# EAGLE design atmega16 laptop keyboard (EAGLE 6.4)
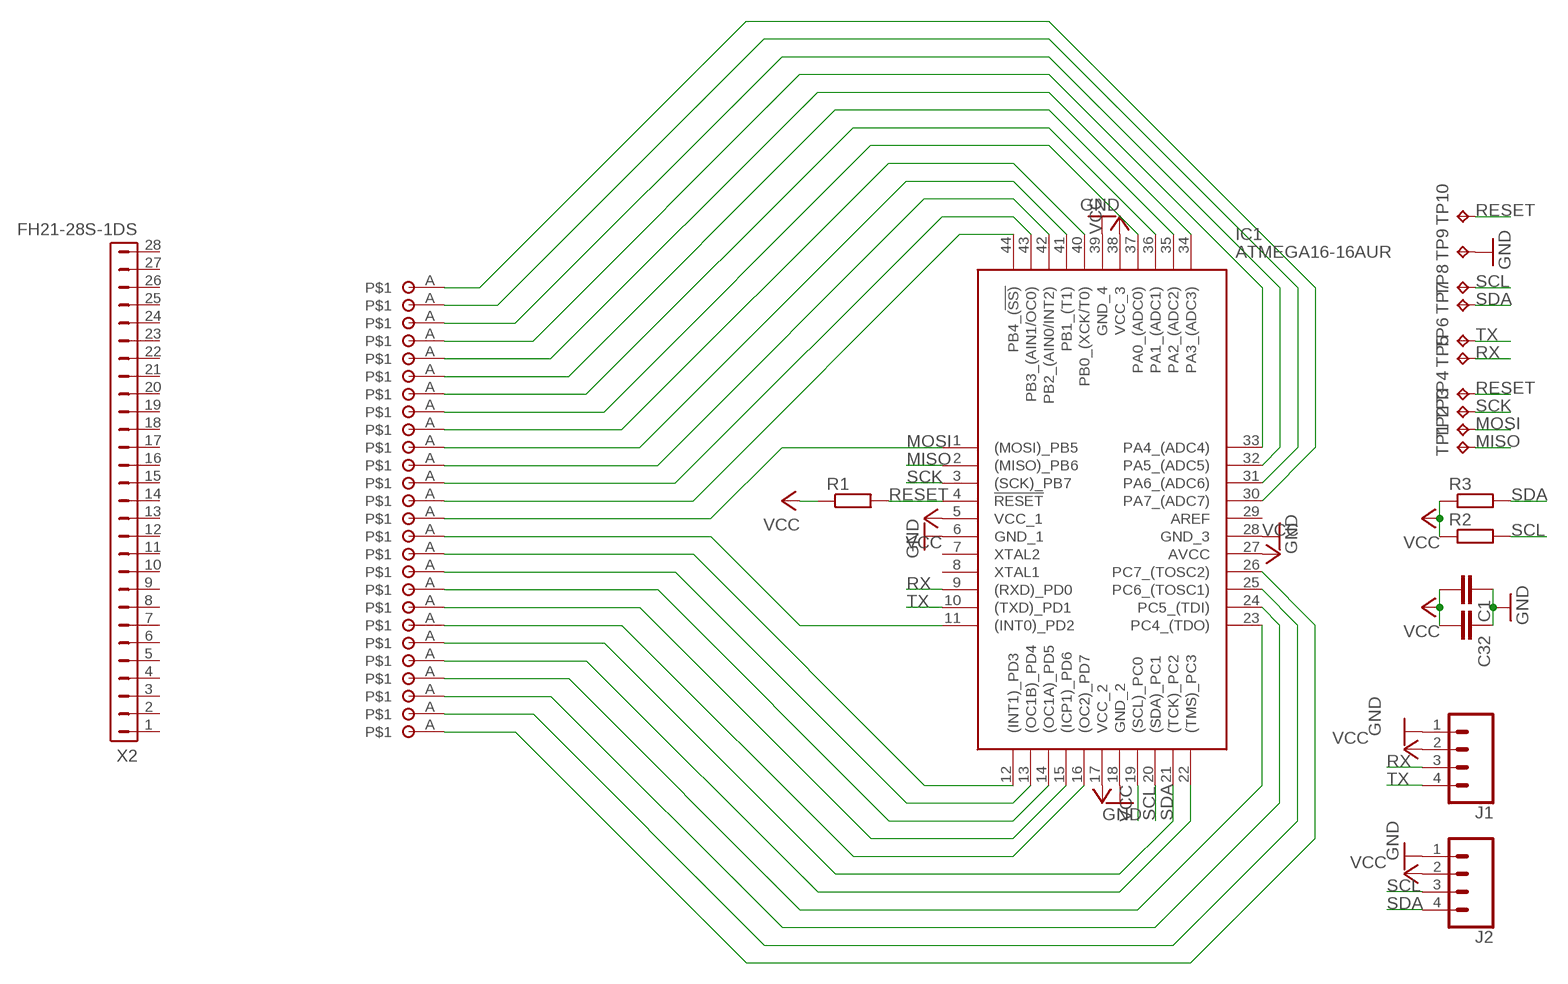
[diagram p0: schematic, sheet 1]

## Parts
C1  C-EUC0805  [C0805]
C32  C-EUC0805  [C0805]
IC1  ATMEGA16-16AUR  [QFP80P1200X1200X120-44N]
J1  CONN_04LONGPADS  [1X04_LONGPADS]
J2  CONN_04LONGPADS  [1X04_LONGPADS]
R1  R-EU_M0805  [M0805]
R2  R-EU_M0805  [M0805]
R3  R-EU_M0805  [M0805]
TP1  TPTP15R  [TP15R]
TP2  TPTP15R  [TP15R]
TP3  TPTP15R  [TP15R]
TP4  TPTP15R  [TP15R]
TP5  TPTP15R  [TP15R]
TP6  TPTP15R  [TP15R]
TP7  TPTP15R  [TP15R]
TP8  TPTP15R  [TP15R]
TP9  TPTP15R  [TP15R]
TP10  TPTP15R  [TP15R]
U$1  PAD1  [PAD1]
U$2  PAD1  [PAD1]
U$3  PAD1  [PAD1]
U$4  PAD1  [PAD1]
U$5  PAD1  [PAD1]
U$6  PAD1  [PAD1]
U$7  PAD1  [PAD1]
U$8  PAD1  [PAD1]
U$9  PAD1  [PAD1]
U$10  PAD1  [PAD1]
U$11  PAD1  [PAD1]
U$12  PAD1  [PAD1]
U$13  PAD1  [PAD1]
U$14  PAD1  [PAD1]
U$15  PAD1  [PAD1]
U$16  PAD1  [PAD1]
U$17  PAD1  [PAD1]
U$18  PAD1  [PAD1]
U$19  PAD1  [PAD1]
U$20  PAD1  [PAD1]
U$21  PAD1  [PAD1]
U$22  PAD1  [PAD1]
U$23  PAD1  [PAD1]
U$24  PAD1  [PAD1]
U$25  PAD1  [PAD1]
U$26  PAD1  [PAD1]
X2  FH21-28S-1DS  [FH21-28S-1DS]

## Nets
GND: C1.1 C32.1 IC1.6(GND_1) IC1.18(GND_2) IC1.28(GND_3) IC1.39(GND_4) J1.1 J2.1 TP9.TP
MISO: IC1.2((MISO)_PB6) TP1.TP
MOSI: IC1.1((MOSI)_PB5) TP2.TP U$14.A
N$1: IC1.11((INT0)_PD2) U$15.A
N$2: IC1.12((INT1)_PD3) U$16.A
N$3: IC1.13((OC1B)_PD4) U$17.A
N$4: IC1.14((OC1A)_PD5) U$18.A
N$5: IC1.15((ICP1)_PD6) U$19.A
N$6: IC1.16((OC2)_PD7) U$20.A
N$7: IC1.21((TCK)_PC2) U$21.A
N$8: IC1.22((TMS)_PC3) U$22.A
N$9: IC1.23(PC4_(TDO)) U$23.A
N$10: IC1.24(PC5_(TDI)) U$24.A
N$11: IC1.25(PC6_(TOSC1)) U$25.A
N$12: IC1.26(PC7_(TOSC2)) U$26.A
N$13: IC1.44(PB4_(!SS)) U$13.A
N$14: IC1.43(PB3_(AIN1/OC0)) U$12.A
N$15: IC1.42(PB2_(AIN0/INT2)) U$11.A
N$16: IC1.41(PB1_(T1)) U$10.A
N$17: IC1.40(PB0_(XCK/T0)) U$9.A
N$18: IC1.37(PA0_(ADC0)) U$8.A
N$19: IC1.36(PA1_(ADC1)) U$7.A
N$20: IC1.35(PA2_(ADC2)) U$6.A
N$21: IC1.34(PA3_(ADC3)) U$5.A
N$22: IC1.33(PA4_(ADC4)) U$4.A
N$23: IC1.32(PA5_(ADC5)) U$3.A
N$24: IC1.31(PA6_(ADC6)) U$2.A
N$25: IC1.30(PA7_(ADC7)) U$1.A
RESET: IC1.4(!RESET) R1.2 TP4.TP TP10.TP
RX: IC1.9((RXD)_PD0) J1.3 TP5.TP
SCK: IC1.3((SCK)_PB7) TP3.TP
SCL: IC1.19((SCL)_PC0) J2.3 R2.2 TP8.TP
SDA: IC1.20((SDA)_PC1) J2.4 R3.2 TP7.TP
TX: IC1.10((TXD)_PD1) J1.4 TP6.TP
VCC: C1.2 C32.2 IC1.5(VCC_1) IC1.17(VCC_2) IC1.27(AVCC) IC1.38(VCC_3) J1.2 J2.2 R1.1 R2.1 R3.1
Unconnected: IC1.7(XTAL2) IC1.8(XTAL1) IC1.29(AREF) X2.1 X2.2 X2.3 X2.4 X2.5 X2.6 X2.7 X2.8 X2.9 X2.10 X2.11 X2.12 X2.13 X2.14 X2.15 X2.16 X2.17 X2.18 X2.19 X2.20 X2.21 X2.22 X2.23 X2.24 X2.25 X2.26 X2.27 X2.28

## Library data of the parts
C1 C32 = resistor:C-EU: CAPACITOR, European symbol
IC1 = SamacSys_Parts:ATMEGA16-16AUR: IC MCU 8BIT 16KB FLASH 44TQFP Source: Datasheet <http://www.microchip.com/mymicrochip/filehandler.aspx?ddocname=en590660>; DESCRIPTION: IC MCU 8BIT 16KB FLASH 44TQFP; HEIGHT: 1.2mm; MANUFACTURER_NAME: Microchip; MANUFACTURER_PART_NUMBER: ATMEGA16-16AUR; MOUSER_PART_NUMBER: 556-ATMEGA16-16AUR; MOUSER_PRICE-STOCK: https://www.mouser.co.uk/ProductDetail/Microchip-Technology-Atmel/ATMEGA16-16AUR?qs=JV7lzlMm3yK8MP63%2FLxWcg%3D%3D
J1 J2 = SparkFun-Connectors:CONN_04: Multi connection point. Often used as Generic Header-pin footprint for 0.1 inch spaced/style header connections On any of the 0.1 inch spaced packages, you can populate with these: Break Away Headers - Straight <https://www.sparkfun.com/products/116> (PRT-00116) Break Away Male Headers - Right Angle <https://www.sparkfun.com/products/553> (PRT-00553) Female Headers <https://www.sparkfun.com/products/115> (PRT-00115) Break Away Headers - Machine Pin <https://www.sparkfun.com/products/117> (PRT-00117) Break Away Female Headers - Swiss Machine Pin <https://www.sparkfun.com/products/743> (PRT-00743) For SCREWTERMINALS and SPRING TERMINALS visit here: Screw Terimnals on SparkFun.com <https://www.sparkfun.com/search/results?term=Screw+Terminals> (5mm/3.5mm/2.54mm spacing) This device is also useful as a general connection point to wire up your design to another part of your project. Our various solder wires solder well into these plated through hole pads. Hook-Up Wire - Assortment (Stranded, 22 AWG) <https://www.sparkfun.com/products/11375> (PRT-11375) Hook-Up Wire - Assortment (Solid Core, 22 AWG) <https://www.sparkfun.com/products/11367> (PRT-11367) View the entire wire category on our website here <https://www.sparkfun.com/categories/141> Special notes: Molex polarized connector foot print use with SKU : PRT-08231 with associated crimp pins and housings. 1MM SMD Version SKU: PRT-10208; PROD_ID: CONN-09696
R1-R3 = rcl:R-EU_: RESISTOR, European symbol
TP1-TP10 = testpad:TP: Test pad
U$1-U$26 = PADS:PAD1
X2 = con-hirose:FH21-28S-1DS: FPC CONNECTOR Source: con-hirose.lbr from Bob Starr <rtzaudio@mindspring.com>; OC_FARNELL: unknown; OC_NEWARK: unknown

## Board
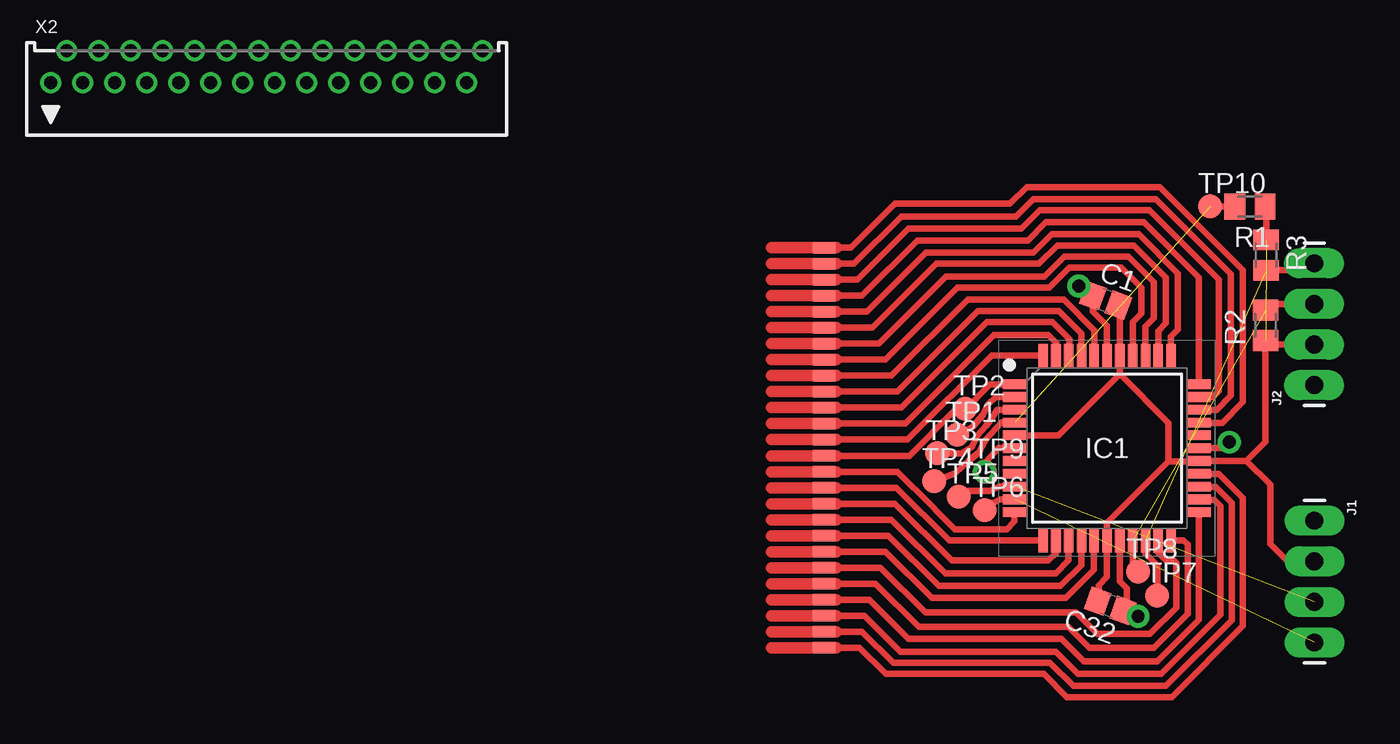
[diagram p1: board, top side]
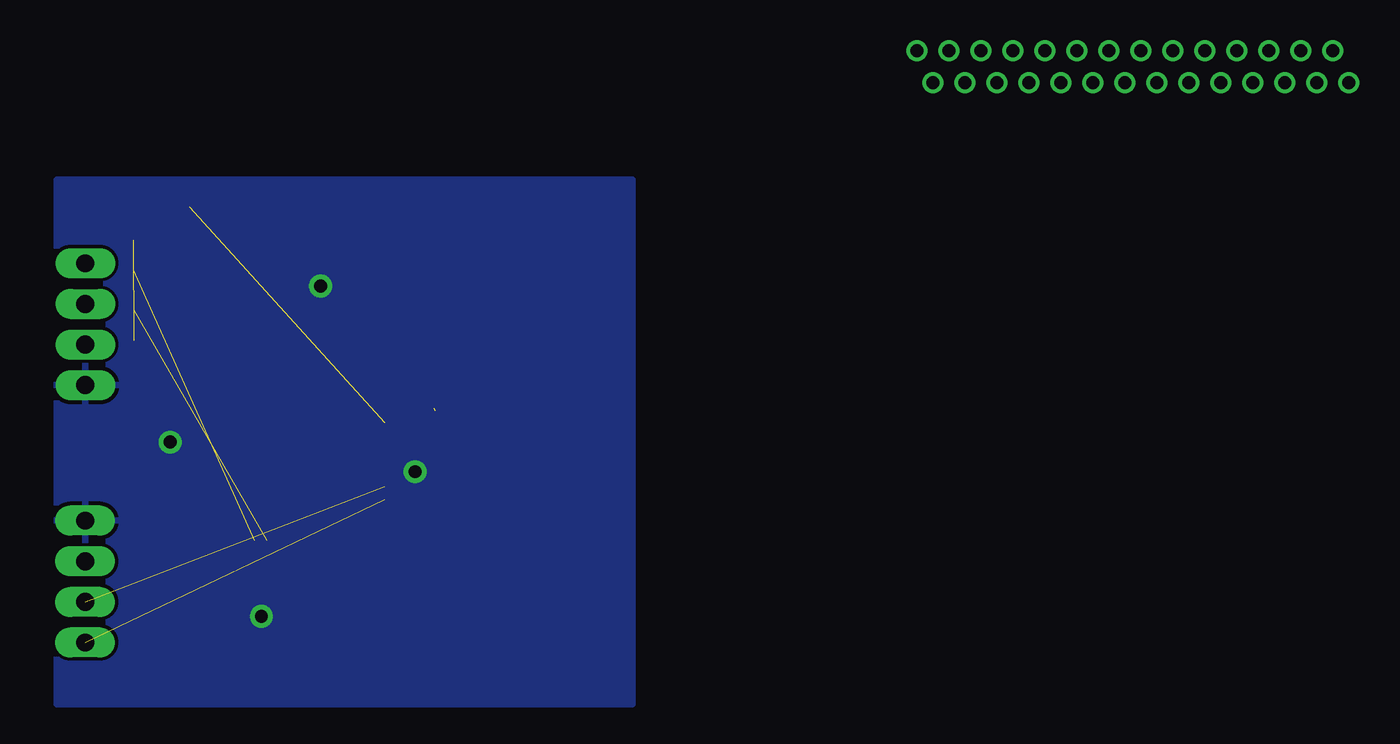
[diagram p2: board, bottom side, seen from below]

No outline drawn. Coordinates in mm, seen from the top.
Copper layers (1*16): Top 0.035mm / dielectric 1.5mm / Bottom 0.035mm
Design rules "default": minimum track width 10mil, minimum drill 24mil, track to track 8mil, track to pad 8mil, pad to pad 8mil, via to via 8mil, smd to smd 8mil, copper to edge 40mil, drill to drill 8mil, minimum pad ring 10mil, minimum via ring 8mil, stop-mask expansion 4mil, vias tented up to drill 0mil, thermal gap 10mil

### Footprints (pad centres in the part's own frame; a part is rotated, then mirrored left to right if it is on the bottom)
C0805 = smd 1.3 x 1.5: 1 -0.85,0; 2 0.85,0
QFP80P1200X1200X120-44N = smd 1.5 x 0.6: 1 -5.75,4; 2 -5.75,3.2; 3 -5.75,2.4; 4 -5.75,1.6; 5 -5.75,0.8; 6 -5.75,0; 7 -5.75,-0.8; 8 -5.75,-1.6; 9 -5.75,-2.4; 10 -5.75,-3.2; 11 -5.75,-4; 23 5.75,-4; 24 5.75,-3.2; 25 5.75,-2.4; 26 5.75,-1.6; 27 5.75,-0.8; 28 5.75,0; 29 5.75,0.8; 30 5.75,1.6; 31 5.75,2.4; 32 5.75,3.2; 33 5.75,4 | smd 0.6 x 1.5: 12 -4,-5.75; 13 -3.2,-5.75; 14 -2.4,-5.75; 15 -1.6,-5.75; 16 -0.8,-5.75; 17 0,-5.75; 18 0.8,-5.75; 19 1.6,-5.75; 20 2.4,-5.75; 21 3.2,-5.75; 22 4,-5.75; 34 4,5.75; 35 3.2,5.75; 36 2.4,5.75; 37 1.6,5.75; 38 0.8,5.75; 39 0,5.75; 40 -0.8,5.75; 41 -1.6,5.75; 42 -2.4,5.75; 43 -3.2,5.75; 44 -4,5.75
1X04_LONGPADS = drill 1.118 pad 1.88 long: 1 0,0; 2 2.54,0; 3 5.08,0; 4 7.62,0
M0805 = smd 1.3 x 1.6: 1 -0.95,0; 2 0.95,0
TP15R = smd 1.5 x 1.5: TP 0,0
PAD1 = smd 1.422 x 0.711: A 0.762,0
FH21-28S-1DS = drill 0.813: 1 -13.5,0; 2 -12.5,2; 3 -11.5,0; 4 -10.5,2; 5 -9.5,0; 6 -8.5,2; 7 -7.5,0; 8 -6.5,2; 9 -5.5,0; 10 -4.5,2; 11 -3.5,0; 12 -2.5,2; 13 -1.5,0; 14 -0.5,2; 15 0.5,0; 16 1.5,2; 17 2.5,0; 18 3.5,2; 19 4.5,0; 20 5.5,2; 21 6.5,0; 22 7.5,2; 23 8.5,0; 24 9.5,2; 25 10.5,0; 26 11.5,2; 27 12.5,0; 28 13.5,2

### Placement (x,y rotation side)
C1  -8.83,-68.19 340 top
C32  -8.54,-87.28 160 top
IC1  -8.74,-77.43 0 top
J1  4.22,-81.96 270 top
J2  4.21,-73.49 90 top
R1  0.19,-62.33 180 top
R2  1.17,-69.74 90 top
R3  1.2,-65.36 270 top
TP1  -18.1,-76.6 0 top
TP2  -17.6,-74.95 0 top
TP3  -19.35,-77.75 0 top
TP4  -19.55,-79.5 0 top
TP5  -18,-80.45 0 top
TP6  -16.4,-81.3 0 top
TP7  -5.6,-86.65 0 top
TP8  -6.8,-85.15 0 top
TP9  -16.4,-78.9 0 top
TP10  -2.3,-62.3 0 top
U$1  -25.65,-64.9 180 top
U$2  -25.65,-65.9 180 top
U$3  -25.65,-66.9 180 top
U$4  -25.65,-67.9 180 top
U$5  -25.65,-68.9 180 top
U$6  -25.65,-69.9 180 top
U$7  -25.65,-70.9 180 top
U$8  -25.65,-71.9 180 top
U$9  -25.65,-72.9 180 top
U$10  -25.65,-73.9 180 top
U$11  -25.65,-74.9 180 top
U$12  -25.65,-75.9 180 top
U$13  -25.65,-76.9 180 top
U$14  -25.65,-77.9 180 top
U$15  -25.65,-78.9 180 top
U$16  -25.65,-79.9 180 top
U$17  -25.65,-80.9 180 top
U$18  -25.65,-81.9 180 top
U$19  -25.65,-82.9 180 top
U$20  -25.65,-83.9 180 top
U$21  -25.65,-84.9 180 top
U$22  -25.65,-85.9 180 top
U$23  -25.65,-86.9 180 top
U$24  -25.65,-87.9 180 top
U$25  -25.65,-88.9 180 top
U$26  -25.65,-89.9 180 top
X2  -61.27,-54.57 0 top

### Tracks (layer width: path | path; a pad name or v marks a point on that pad's centre or on a via)
GND  (via drill 0.8 pad 1.42)
  Top 0.406: IC1.18 -7.94,-85.76 -7.5,-86.2 -7.5,-87.11 C32.1 -7.36,-87.95 v-6.8,-87.95 | IC1.6 -15.53,-77.43 -16.3,-78.3 TP9.TP | IC1.39 -8.75,-69.75 -9.63,-68.87 C1.1 -10.23,-67.3 v-10.5,-67.3 | IC1.28 -1.48,-77.43 v-1.1,-77.05
  other vias: -16.4,-78.9
  pour Bottom: -30,-93.45 6,-93.45 6,-60.65 -30,-60.65
MISO
  Top 0.406: IC1.2 -15.68,-74.23 -16.2,-74.7 -16.5,-75.35 -17.15,-76.1 TP1.TP
MOSI  (1 unrouted)
  Top 0.406: U$14.A -21.1,-77.9 -18.3,-75.1 -17.7,-75.1 -16.05,-73.45 -14.51,-73.45 IC1.1
N$1
  Top 0.406: U$15.A -21.85,-78.9 -19.7,-81.05 -19.35,-81.4 -18.25,-82.5 -15,-82.5 -14.52,-82.02 -14.52,-81.4 IC1.11
N$2
  Top 0.406: U$16.A -21.9,-79.9 -18.6,-83.2 -12.76,-83.2 IC1.12
N$3
  Top 0.406: U$17.A -22,-80.9 -18.45,-84.45 -12.4,-84.45 -11.95,-84 IC1.13
N$4
  Top 0.406: U$18.A -22.2,-81.9 -18.85,-85.25 -11.95,-85.25 -11.15,-84.45 IC1.14
N$5
  Top 0.406: U$19.A -22.4,-82.9 -19.25,-86.05 -11.65,-86.05 -10.35,-84.75 IC1.15
N$6
  Top 0.406: U$20.A -22.6,-83.9 -19.7,-86.8 -11.3,-86.8 -9.55,-85.05 IC1.16
N$7
  Top 0.406: U$21.A -22.9,-84.9 -20.1,-87.7 -10.7,-87.7 -9.35,-89.05 -6.05,-89.05 -4.4,-87.4 -4.4,-84.6 -4.6,-84.4 -5.1,-84.4 -5.55,-83.95 IC1.21
N$8
  Top 0.406: U$22.A -23.2,-85.9 -20.5,-88.6 -11.15,-88.6 -9.85,-89.9 -5.8,-89.9 -3.7,-87.8 -3.7,-83.45 -3.96,-83.19 IC1.22
N$9
  Top 0.406: U$23.A -23.6,-86.9 -21.15,-89.35 -11.6,-89.35 -10.2,-90.75 -5.6,-90.75 -3,-88.15 IC1.23
N$10
  Top 0.406: U$24.A -23.9,-87.9 -21.65,-90.15 -11.95,-90.15 -10.55,-91.55 -5.35,-91.55 -1.65,-87.85 -1.65,-81.05 -2.05,-80.65 -2.97,-80.65 IC1.24
N$11
  Top 0.406: U$25.A -24.05,-88.9 -22.1,-90.85 -12.3,-90.85 -10.85,-92.3 -5.05,-92.3 -0.95,-88.2 -0.95,-80.85 -1.95,-79.85 -2.97,-79.85 IC1.25
N$12
  Top 0.406: U$26.A -24.2,-89.9 -22.55,-91.55 -12.7,-91.55 -11.25,-93 -4.7,-93 -0.25,-88.55 -0.25,-80.55 -1.75,-79.05 -2.97,-79.05 IC1.26
N$13
  Top 0.406: U$13.A -21.2,-76.9 -15.95,-71.65 -12.77,-71.65 IC1.44
N$14
  Top 0.406: U$12.A -21.35,-75.9 -15.8,-70.35 -12.4,-70.35 -11.9,-70.85 -11.9,-71.64 IC1.43
N$15
  Top 0.406: U$11.A -21.6,-74.9 -16.25,-69.55 -12.15,-69.55 -11.1,-70.6 -11.1,-71.64 IC1.42
N$16
  Top 0.406: IC1.41 -10.34,-70.26 -11.75,-68.85 -16.8,-68.85 -21.85,-73.9 U$10.A
N$17
  Top 0.406: IC1.40 -9.54,-70.06 -11.45,-68.15 -17.45,-68.15 -22.2,-72.9 U$9.A
N$18
  Top 0.406: IC1.37 -7.14,-69.54 -6.6,-69 -6.6,-67.4 -7.85,-66.15 -11.1,-66.15 -12.35,-67.4 -18.1,-67.4 -22.6,-71.9 U$8.A
N$19
  Top 0.406: IC1.36 -6.34,-69.84 -5.8,-69.3 -5.8,-67.05 -7.4,-65.45 -11.4,-65.45 -12.65,-66.7 -18.8,-66.7 -23,-70.9 U$7.A
N$20
  Top 0.406: IC1.35 -5.54,-70.09 -5.05,-69.6 -5.05,-66.75 -7.05,-64.75 -11.85,-64.75 -13,-65.9 -19.4,-65.9 -23.4,-69.9 U$6.A
N$21
  Top 0.406: IC1.34 -4.74,-70.44 -4.3,-70 -4.3,-66.5 -6.75,-64.05 -12.2,-64.05 -13.35,-65.2 -20.05,-65.2 -23.75,-68.9 U$5.A
N$22
  Top 0.406: IC1.33 -2.99,-66.76 -6.45,-63.3 -12.55,-63.3 -13.7,-64.45 -20.6,-64.45 -24.05,-67.9 U$4.A
N$23
  Top 0.406: IC1.32 -2.13,-74.23 -1.75,-73.85 -1.75,-66.9 -6.1,-62.55 -12.95,-62.55 -14.1,-63.7 -21.15,-63.7 -24.35,-66.9 U$3.A
N$24
  Top 0.406: IC1.31 -1.88,-75.03 -1,-74.15 -1,-66.55 -5.7,-61.85 -13.35,-61.85 -14.45,-62.95 -21.6,-62.95 -24.55,-65.9 U$2.A
N$25
  Top 0.406: U$1.A -24.75,-64.9 -22,-62.15 -14.8,-62.15 -13.75,-61.1 -5.45,-61.1 -0.25,-66.3 -0.25,-74.55 -1.55,-75.85 -2.97,-75.85 IC1.30
RESET  (1 unrouted)
  Top 0.406: IC1.4 -15.33,-75.83 -16.3,-76.9 -16.75,-77.7 -17.45,-78.25 -18.25,-79 TP4.TP | R1.2 -2.27,-62.33 TP10.TP
RX  (1 unrouted)
  Top 0.406: IC1.9 -15.48,-79.83 -16.05,-80.1 -17.7,-80.1 TP5.TP
SCK
  Top 0.406: IC1.3 -15.63,-75.03 -15.9,-75.5 -16.3,-76.05 -16.85,-76.65 -17.2,-77.35 -17.85,-77.75 TP3.TP -19.15,-77.95
SCL  (1 unrouted)
  Top 0.406: IC1.19 -7.14,-84.71 TP8.TP | J2.3 1.55,-68.41 R2.2
SDA  (1 unrouted)
  Top 0.406: IC1.20 -6.34,-84.01 -5.6,-84.75 TP7.TP | R3.2 3.77,-66.31 J2.4
TX  (1 unrouted)
  Top 0.406: IC1.10 -15.43,-80.63 -15.85,-80.85 -15.95,-80.85 TP6.TP
VCC  (1 unrouted)
  Top 0.406: C32.2 -9.25,-87.08 -9.25,-86 -8.74,-85.49 IC1.17 -8.74,-82.09 -4.9,-78.25 | IC1.5 -11.78,-76.63 -7.95,-72.8 | -7.95,-72.8 IC1.38 -7.94,-68.57 C1.2 | -4.9,-78.25 -3.01,-78.25 IC1.27 -0.03,-78.23 | -4.9,-78.25 -4.9,-75.85 -7.95,-72.8 | J1.2 2.55,-84.5 1.45,-83.4 1.45,-79.71 -0.03,-78.23 | J2.2 1.43,-70.95 R2.1 1.15,-70.71 1.15,-77.05 -0.03,-78.23 | R3.1 1.2,-62.39 R1.1